# Altium schematic sheet 03_ICs.SchDoc: ICs
size A; Revision: A; SheetNumber: 3; SheetTotal: 4; ECE315_Project_Name: S25 Brushed DC Motor - Student
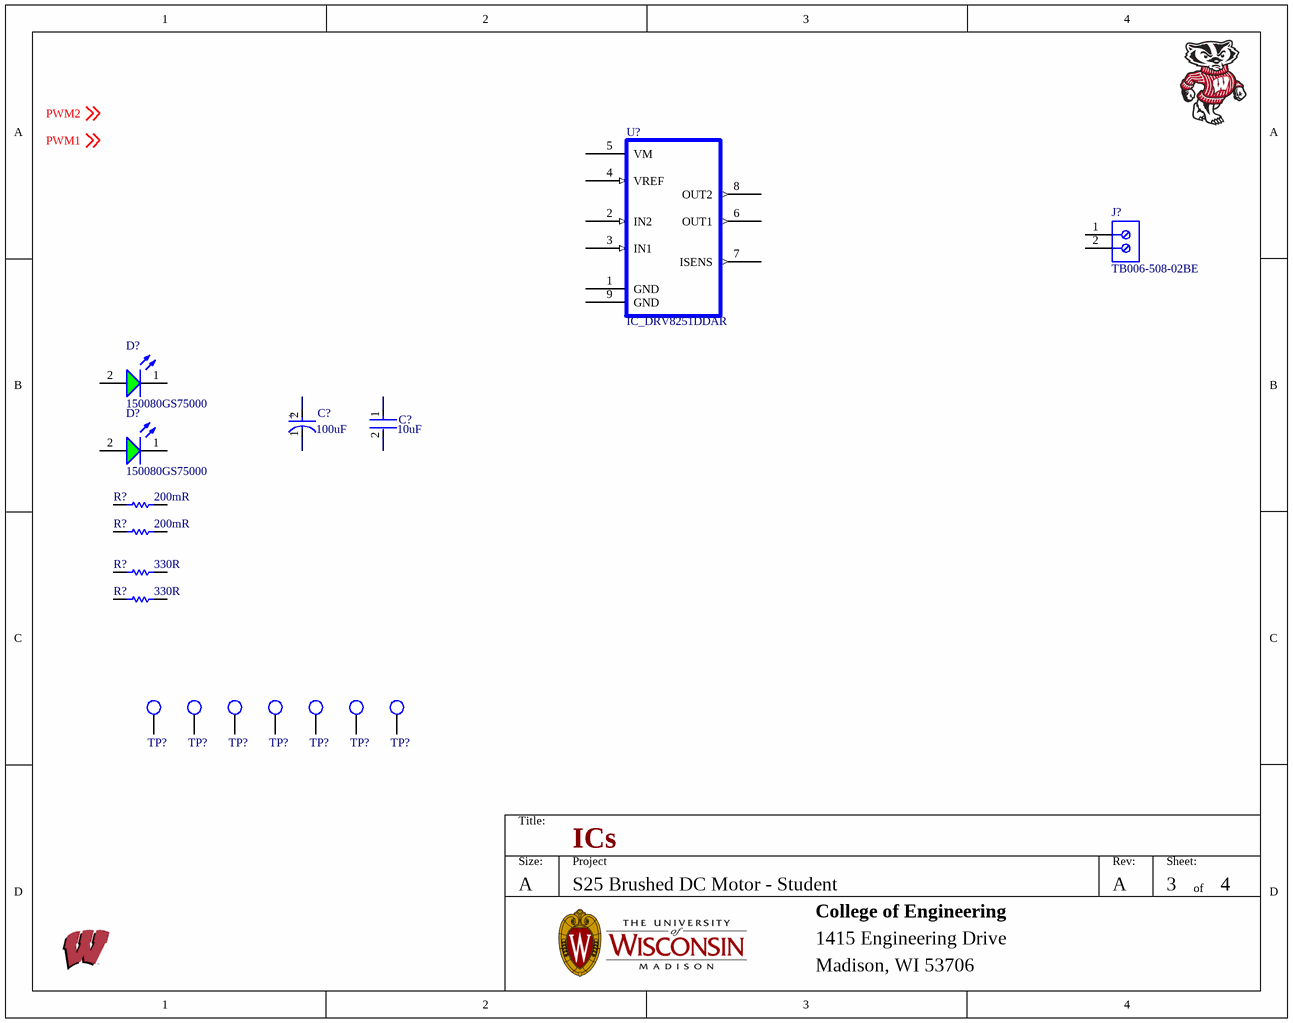
[diagram p0: 03_ICs.SchDoc]

## Parts
(Parts that share a designator on the sheet are numbered #1, #2 ... from top to bottom, then left to right.)
C?#1  value 100uF  [FP-SD8-MFG]  (hidden comment: EEE-1EA101XP)
C?#2  value 10uF  [FP-C0805C-DG-MFG]  (hidden comment: C0805C106K8PACTU)
D?#1  150080GS75000  [WL-SMCW_0805_150080xx75000]
D?#2  150080GS75000  [WL-SMCW_0805_150080xx75000]
J?  Manufacturer Part Number: TB006-508-02BE  [CUI_TB006 -508-02BE]  (hidden comment: CONN_TB006_-508-02BE)
R?#1  value 200mR  [RESC2013X60X40LL20T25]  (hidden comment: ERJ-6DSFR20V)
R?#2  value 200mR  [RESC2013X60X40LL20T25]  (hidden comment: ERJ-6DSFR20V)
R?#3  value 330R  [RESC2013X60X40LL20T25]  (hidden comment: ERA6AEB331V)
R?#4  value 330R  [RESC2013X60X40LL20T25]  (hidden comment: ERA6AEB331V)
TP?#1  TP_5019  [FP-5019-MFG]  (value not drawn)
TP?#2  TP_5019  [FP-5019-MFG]  (value not drawn)
TP?#3  TP_5019  [FP-5019-MFG]  (value not drawn)
TP?#4  TP_5019  [FP-5019-MFG]  (value not drawn)
TP?#5  TP_5019  [FP-5019-MFG]  (value not drawn)
TP?#6  TP_5019  [FP-5019-MFG]  (value not drawn)
TP?#7  TP_5019  [FP-5019-MFG]  (value not drawn)
U?  IC_DRV8251DDAR  [SOIC_8_PP]

## Nets

Not connected (* = marked no-connect by the designer): C?#1 1(C) 2(A); C?#2 1 2; D?#1 1(K) 2(A); D?#2 1(K) 2(A); J? 1 2; R?#1 1 2; R?#2 1 2; R?#3 1 2; R?#4 1 2; TP?#1 1; TP?#2 1; TP?#3 1; TP?#4 1; TP?#5 1; TP?#6 1; TP?#7 1; U? 1(GND) 2(IN2) 3(IN1) 4(VREF) 5(VM) 6(OUT1) 7(ISENS) 8(OUT2) 9(GND)

## Notes on the sheet
- Labels drawn without touching a wire or pin: PWM1, PWM2
- Title:
- Size:
- A
- Project
- Rev:
- Sheet:
- of
- College of Engineering
- 1415 Engineering Drive
- Madison, WI 53706
- (in symbol CMP-05427-000061-1) +

## Library data of the parts
C?#1 = CMP-05427-000061-1: CAP ALUM 100UF 20% 25V SMD; Manufacturer: Panasonic; Leakage Current: 3uA; Life (Hours): 2000Hour; Ripple Current: 143mA; Polarity: Polar; Dissipation Factor: 14%; Height - Seated (Max): 0.303inch; Contact Plating: Tin; Max Operating Temperature: 85°C; Package Quantity: 900; RoHS Compliant: Yes; Termination: SMD/SMT; Lead Free: Lead Free; Min Operating Temperature: -40°C; Radiation Hardening: No; Length: 8mm; Height: 7.7mm; Series: S; Voltage Rating: 25V; Capacitance: 100uF; Diameter: 6.3mm; Ripple Current (AC): 143mA; Case/Package: Radial; Packaging: Tape and Reel; Voltage: 25V; Tolerance: 20%; Construction: Cylindrical; Voltage Rating (DC): 25V; Mount: Surface Mount; Supplier: Digikey; Supplier Part Number: PCE3898CT-ND; Manufacturer Part Number: EEE-1EA101XP; RoHS: Yes; Category: Aluminum Electrolytic Capacitors; Stock: 41776; Pricing: 1=0.51, 10=0.338, 50=0.2488, 100=0.2025 (USD); Mounting Technology: Surface Mount,PCB; Ratings: AEC-Q200; Reach SVHC Compliant: Unknown; ComponentLink1URL: https://datasheet.ciiva.com/30108/11aba0000ce2-30108047.pdf?src-supplier=Onlinecomponents.com; ComponentLink1Description: https://datasheet.ciiva.com/30108/11aba0000ce2-30108047.pdf?src-supplier=Onlinecomponents.com; ComponentLink2URL: https://datasheet.ciiva.com/16201/aba0000ce2-16201065.pdf?src-supplier=Future+Electronics; ComponentLink2Description: https://datasheet.ciiva.com/16201/aba0000ce2-16201065.pdf?src-supplier=Future+Electronics; ComponentLink3URL: https://datasheet.ciiva.com/24022/aba0000ce2-40801-24022875.pdf?src-supplier=Mouser; ComponentLink3Description: https://datasheet.ciiva.com/24022/aba0000ce2-40801-24022875.pdf?src-supplier=Mouser
C?#2 = CMP-2007-03243-2: CAP CER 10UF 10V X5R 0805; Manufacturer: KEMET; Dielectric Material: Ceramic; Material: 4241ConductorMaterial; Tolerance: 10%; ComponentLink2URL: https://content.kemet.com/datasheets/KEM_C1006_X5R_SMD.pdf; ComponentLink2Description: Datasheet; Supplier: Digikey; Supplier Part Number: 399-C0805C106K8PAC7800CT-ND; Manufacturer Part Number: C0805C106K8PACTU; RoHS: Yes; Category: Ceramic Capacitors; Stock: 5202928; Pricing: 1=0.14, 10=0.098, 50=0.0584, 100=0.0459, 500=0.03388, 1000=0.02805 (USD); Mounting Technology: Surface Mount; Case/Package: 0805; Pins: 2; Contact Plating: Tin,Matte; Case Code (Imperial): 0805; Case Code (Metric): 2012; Min Operating Temperature: -55°C; Max Operating Temperature: 85°C; Packaging: Tape and Reel; Dielectric: X5R; Voltage Rating (DC): 10V; Termination: SMD/SMT; Package Quantity: 1; Voltage Rating: 10V; Voltage: 10V; Dissipation Factor: 10%; Series: C; Construction: Flat; Length: 2mm; Width: 0.049inch; Height: 1.25mm; Depth: 1.25mm; Thickness: 0.055inch; Radiation Hardening: No; Reach SVHC Compliant: No; Lead Free: Lead Free; RoHS Compliant: Yes; ComponentLink1URL: https://datasheet.ciiva.com/22704/1732709-22704859.pdf?src-supplier=Element14; ComponentLink1Description: https://datasheet.ciiva.com/22704/1732709-22704859.pdf?src-supplier=Element14; ComponentLink3URL: https://datasheet.ciiva.com/7842/1732709-7842198.pdf?src-supplier=Element14; ComponentLink3Description: https://datasheet.ciiva.com/7842/1732709-7842198.pdf?src-supplier=Element14; ComponentLink4URL: https://datasheet.ciiva.com/7842/40889-7842552.pdf?src-supplier=Element14; ComponentLink4Description: https://datasheet.ciiva.com/7842/40889-7842552.pdf?src-supplier=Element14
D?#1 D?#2 = CMP-1426-00007-2: LED GREEN CLEAR 0805 SMD; NexarPartId: 29717780; Manufacturer: Wurth Electronics; Wavelength: 520nm; Forward Current: 100mA; Lens Style: Clear, Rectangular; Dominant Wavelength: 525nm; Max Junction Temperature (Tj): 95°C; Power Dissipation: 105mW; Luminous Intensity: 450mcd; Peak Wavelength: 515nm; Viewing Angle: 140°; Test Current: 20mA; Reverse Voltage: 5V; Forward Voltage: 3.2V; Lens Color: Colorless; Lens Size: 1.25mm; Mount: Surface Mount; REACH SVHC: Unknown; Min Operating Temperature: -40°C; Case Code (Imperial): 0805; Case/Package: 0805; Max Operating Temperature: 85°C; RoHS: Compliant; Length: 2mm; Height: 700µm; Width: 1.25mm; Color: Green; Case Code (Metric): 2012; Packaging: Tape and Reel; Max Reverse Voltage (DC): 5V; Supplier: Digikey; Supplier Part Number: 732-4983-1-ND; Manufacturer Part Number: 150080GS75000; Category: LEDs; Stock: 34895; Pricing: 1=0.19, 50=0.176, 100=0.151, 500=0.131 (USD); Mounting Technology: Surface Mount; Package Quantity: 1; Series: WL-SMCW; Lens Transparency: Clear; RoHS Compliant: Yes; Reach SVHC Compliant: Unknown; ComponentLink1URL: https://datasheet.ciiva.com/29563/150080gs75000-29563008.pdf?src-supplier=Digikey; ComponentLink1Description: https://datasheet.ciiva.com/29563/150080gs75000-29563008.pdf?src-supplier=Digikey; ComponentLink2URL: https://datasheet.ciiva.com/29279/759434-da-01-en-chipled-0805-w-kl-gruen-150080gs75000-29279039.pdf?src-supplier=Conrad; ComponentLink2Description: https://datasheet.ciiva.com/29279/759434-da-01-en-chipled-0805-w-kl-gruen-150080gs75000-29279039.pdf?src-supplier=Conrad
J? = CONN_TB006_-508-02BE: 2~24 Poles, Screw Type, Horizontal, 5.08 Pitch, 26~14 (AWG), Terminal Block Connector; MF: CUI Devices; MP: TB006 -508-02BE; CUI_purchase_URL: https://www.cuidevices.com/product/interconnect/connectors/terminal-blocks/tb006-508-series?utm_source=snapeda.com&utm_medium=referral&utm_campaign=snapedaBOM; Value: *; Check_prices: https://www.snapeda.com/parts/TB006%20-508-02BE/CUI+Devices/view-part/?ref=eda; SnapEDA_Link: https://www.snapeda.com/parts/TB006%20-508-02BE/CUI+Devices/view-part/?ref=snap; Availability: In Stock; Package: None; Purchase-URL: https://pricing.snapeda.com/search/part/TB006 -508-02BE/?ref=eda; Price: None; Supplier 1: Digikey; Supplier Part Number 1: 102-6191-ND; Manufacturer: CUI Devices; RoHS: Yes; Category: Terminal Blocks; Stock: 47249; Pricing: 1=0.73, 10=0.402, 25=0.3, 50=0.2676, 100=0.2623, 250=0.23084, 500=0.20984, 1000=0.18886, 5000=0.14164 (USD)
R?#1 R?#2 = CMP-2001-00628-1: RES 0.2 OHM 1% 1/2W 0805; Manufacturer: Panasonic; Max Power Dissipation: 500mW; Temperature Coefficient: 150ppm/°C; Supplier: Digikey; Supplier Part Number: P19315CT-ND; Manufacturer Part Number: ERJ-6DSFR20V; RoHS: Yes; Category: Chip SMD Resistors; Stock: 49000; Pricing: 1=0.46, 10=0.314, 25=0.2444, 50=0.18, 100=0.1253, 250=0.1092, 500=0.09004, 1000=0.06514 (USD); Case/Package: 0805; Case Code (Metric): 2012; Case Code (Imperial): 0805; Min Operating Temperature: -55°C; Max Operating Temperature: 155°C; Packaging: Cut Tape; Number of Terminations: 2; Tolerance: 1%; Features: Automotive AEC-Q200; Series: ERJ; Length: 0.079inch; Width: 0.049inch; Height: 0.028inch; ComponentLink1URL: http://www.farnell.com/datasheets/2883947.pdf?src-supplier=Newark; ComponentLink1Description: http://www.farnell.com/datasheets/2883947.pdf?src-supplier=Newark; ComponentLink2URL: https://industrial.panasonic.com/cdbs/www-data/pdf/RDN0000/AOA0000C313.pdf?src-supplier=Digikey; ComponentLink2Description: https://industrial.panasonic.com/cdbs/www-data/pdf/RDN0000/AOA0000C313.pdf?src-supplier=Digikey
R?#3 R?#4 = CMP-2001-00628-1: RES SMD 330 OHM 1% 1/8W 0805; Manufacturer: Panasonic; Manufacturer Part Number: ERJ-6ENF3300V; Voltage Rating: 150V; Power Rating: 125mW; Temperature Coefficient: 100ppm/°C; ComponentLink1URL: https://datasheet.ciiva.com/11808/0900766b80eb1d8c-11808093.pdf?src-supplier=Rs; ComponentLink1Description: https://datasheet.ciiva.com/11808/0900766b80eb1d8c-11808093.pdf?src-supplier=Rs; ComponentLink2URL: https://datasheet.ciiva.com/29184/452857-da-01-en-widerstand-0805-era-29184079.pdf?src-supplier=Conrad; ComponentLink2Description: https://datasheet.ciiva.com/29184/452857-da-01-en-widerstand-0805-era-29184079.pdf?src-supplier=Conrad; ComponentLink3URL: https://datasheet.ciiva.com/9182/aoa0000ce26-9182968.pdf?src-supplier=Avnet; ComponentLink3Description: https://datasheet.ciiva.com/9182/aoa0000ce26-9182968.pdf?src-supplier=Avnet; ComponentLink4URL: https://datasheet.ciiva.com/48536/era-eng-tds-48536857.pdf?src-supplier=Distrelec; ComponentLink4Description: https://datasheet.ciiva.com/48536/era-eng-tds-48536857.pdf?src-supplier=Distrelec; ComponentLink5URL: https://datasheet.ciiva.com/22759/485442-22759176.pdf?src-supplier=Farnell; ComponentLink5Description: https://datasheet.ciiva.com/22759/485442-22759176.pdf?src-supplier=Farnell; ComponentLink6URL: https://datasheet.ciiva.com/6138/485442-6138589.pdf?src-supplier=Farnell; ComponentLink6Description: https://datasheet.ciiva.com/6138/485442-6138589.pdf?src-supplier=Farnell; ComponentLink7URL: https://datasheet.ciiva.com/43457/485442-43457816.pdf?src-supplier=Farnell; ComponentLink7Description: https://datasheet.ciiva.com/43457/485442-43457816.pdf?src-supplier=Farnell; ComponentLink8URL: https://datasheet.ciiva.com/6138/485442-6138585.pdf?src-supplier=Farnell; ComponentLink8Description: https://datasheet.ciiva.com/6138/485442-6138585.pdf?src-supplier=Farnell; ComponentLink9URL: https://datasheet.ciiva.com/24164/aoa0000ce26-197354-24164407.pdf?src-supplier=Mouser; ComponentLink9Description: https://datasheet.ciiva.com/24164/aoa0000ce26-197354-24164407.pdf?src-supplier=Mouser; ComponentLink10URL: https://datasheet.ciiva.com/22744/1776116-22744153.pdf?src-supplier=Element14; ComponentLink10Description: https://datasheet.ciiva.com/22744/1776116-22744153.pdf?src-supplier=Element14; ComponentLink11URL: https://datasheet.ciiva.com/46436/485442-46436606.pdf?src-supplier=Element14; ComponentLink11Description: https://datasheet.ciiva.com/46436/485442-46436606.pdf?src-supplier=Element14; ComponentLink12URL: https://datasheet.ciiva.com/16777/70068849-16777611.pdf?src-supplier=Allied+Electronics; ComponentLink12Description: https://datasheet.ciiva.com/16777/70068849-16777611.pdf?src-supplier=Allied+Electronics; ComponentLink13URL: https://datasheet.ciiva.com/30237/54aoa0000ce26-30237450.pdf?src-supplier=Onlinecomponents.com; ComponentLink13Description: https://datasheet.ciiva.com/30237/54aoa0000ce26-30237450.pdf?src-supplier=Onlinecomponents.com; Supplier: Digikey; Supplier Part Number: P330CCT-ND; RoHS: Yes; Category: Chip SMD Resistors; Stock: 40201; Pricing: 1=0.11, 10=0.053, 50=0.0344, 100=0.0292, 500=0.02058, 1000=0.01792 (USD); Mounting Technology: Surface Mount; Case/Package: 0805; Pins: 2; Case Code (Imperial): 0805; Case Code (Metric): 2012; Contact Plating: Tin; Min Operating Temperature: -55°C; Max Operating Temperature: 155°C; Packaging: Tape and Reel; Tolerance: 1%; Package Quantity: 1; Resistor Type: Thick Film; Number of Terminations: 2; Termination: SMD/SMT; Max Power Dissipation: 125mW; Series: ERJ; Resistance Tolerance: 1%; Technology: THICK FILM; Construction: Rectangular; Voltage Rating (DC): 150V; Features: Automotive AEC-Q200; Length: 2mm; Width: 1.2mm; Height: 0.6mm; Depth: 1.25mm; Reach SVHC Compliant: No; Military Standard: Not; RoHS Compliant: Yes; ComponentLink14URL: https://datasheet.ciiva.com/11821/0900766b80f80784-11821635.pdf?src-supplier=Rs; ComponentLink14Description: https://datasheet.ciiva.com/11821/0900766b80f80784-11821635.pdf?src-supplier=Rs; ComponentLink15URL: https://datasheet.ciiva.com/24025/aoa0000ce2-24025991.pdf?src-supplier=Mouser; ComponentLink15Description: https://datasheet.ciiva.com/24025/aoa0000ce2-24025991.pdf?src-supplier=Mouser
TP?#1-TP?#7 = TP_5019: Test Point, Mini, SMT, Phos Bronze/Silver, 1000pc Tape & Reel | Keystone Electronics 5019; Manufacturer Part Number: 5019; Plating: Silver; Body Material: Bronze; Number of Contacts: 1NUMBER; Supplier 1: Digikey; Supplier Part Number 1: 36-5019CT-ND; Manufacturer: Keystone Electronics; RoHS: Yes; Category: Terminals; Stock: 282853; Pricing: 1=0.37, 25=0.2496, 100=0.2117, 250=0.1902, 500=0.1756, 1000=0.16229, 2000=0.15019, 3000=0.14362, 5000=0.13585, 7000=0.13102, 10000=0.12613, 25000=0.1211 (USD); Mounting Technology: Surface Mount,PCB; Pins: 1; Contact Plating: Silver; Contact Material: Bronze; Material: Bronze; Packaging: Tape and Reel; Package Quantity: 1; Termination: SMD/SMT; Series: 5019; Height: 0.09inch; Reach SVHC Compliant: No; RoHS Compliant: Yes; Lead Free: Lead Free; ComponentLink1URL: https://datasheet.ciiva.com/14848/m60-2p61-14848437.pdf?src-supplier=Digikey; ComponentLink1Description: https://datasheet.ciiva.com/14848/m60-2p61-14848437.pdf?src-supplier=Digikey; ComponentLink2URL: https://datasheet.ciiva.com/14848/m60-2p61-14848438.pdf?src-supplier=Digikey; ComponentLink2Description: https://datasheet.ciiva.com/14848/m60-2p61-14848438.pdf?src-supplier=Digikey; ComponentLink3URL: https://datasheet.ciiva.com/14848/m60-2p61-14848439.pdf?src-supplier=Digikey; ComponentLink3Description: https://datasheet.ciiva.com/14848/m60-2p61-14848439.pdf?src-supplier=Digikey; ComponentLink4URL: https://datasheet.ciiva.com/16885/70182998-16885945.pdf?src-supplier=Allied+Electronics; ComponentLink4Description: https://datasheet.ciiva.com/16885/70182998-16885945.pdf?src-supplier=Allied+Electronics; ComponentLink5URL: https://datasheet.ciiva.com/16318/m60-2p61-16318395.pdf?src-supplier=Future+Electronics; ComponentLink5Description: https://datasheet.ciiva.com/16318/m60-2p61-16318395.pdf?src-supplier=Future+Electronics
U? = IC_DRV8251DDAR: 48-V, 3.5-A H bridge motor driver with current regulation and latched OCP 8-SO PowerPAD -40 to 150; Manufacturer: Texas Instruments; Supplier 1: Digi-Key; Supplier Part Number 1: 296-DRV8251DDARCT-ND; Manufacturer Part Number: DRV8251DDAR; RoHS: No; Category: Integrated Circuits (ICs); Stock: 4730; Pricing: 1=1.66, 10=1.495, 25=1.4108, 100=1.202, 250=1.12868, 500=0.9876, 1000=0.81829 (USD)